# EAGLE design led_power_decoupling (EAGLE 7.7.0)
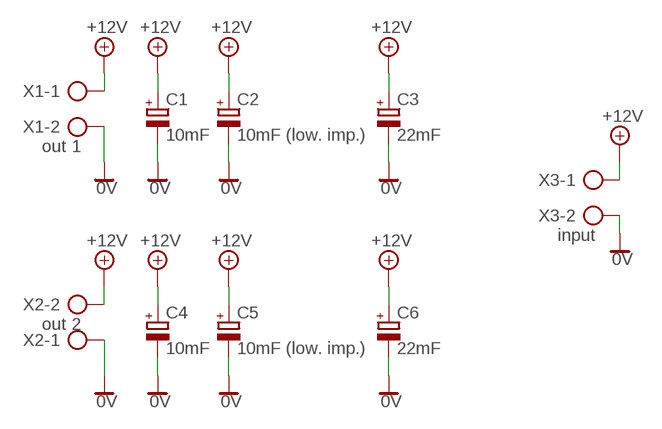
[diagram p0: schematic, sheet 1]

## Parts
C1  10mF  CPOL-EUE7.5-16  [E7,5-16]
C2  10mF (low. imp.)  CPOL-EUE7.5-18  [E7,5-18]
C3  22mF  CPOL-EUE10-25  [EB25D]
C4  10mF  CPOL-EUE7.5-16  [E7,5-16]
C5  10mF (low. imp.)  CPOL-EUE7.5-18  [E7,5-18]
C6  22mF  CPOL-EUE10-25  [EB25D]
X1  out 1  AK500/2  [AK500/2]
X2  out 2  AK500/2  [AK500/2]
X3  input  AK500/2  [AK500/2]

## Nets
0V: C1.- C2.- C3.- C4.- C5.- C6.- X1.2 X2.1 X3.2
+12V: C1.+ C2.+ C3.+ C4.+ C5.+ C6.+ X1.1 X2.2 X3.1

## Library data of the parts
C1-C6 = rcl:CPOL-EU: POLARIZED CAPACITOR, European symbol
X1-X3 = con-ptr500:AK500/2: CONNECTOR; OC_FARNELL: unknown; OC_NEWARK: unknown

## Board
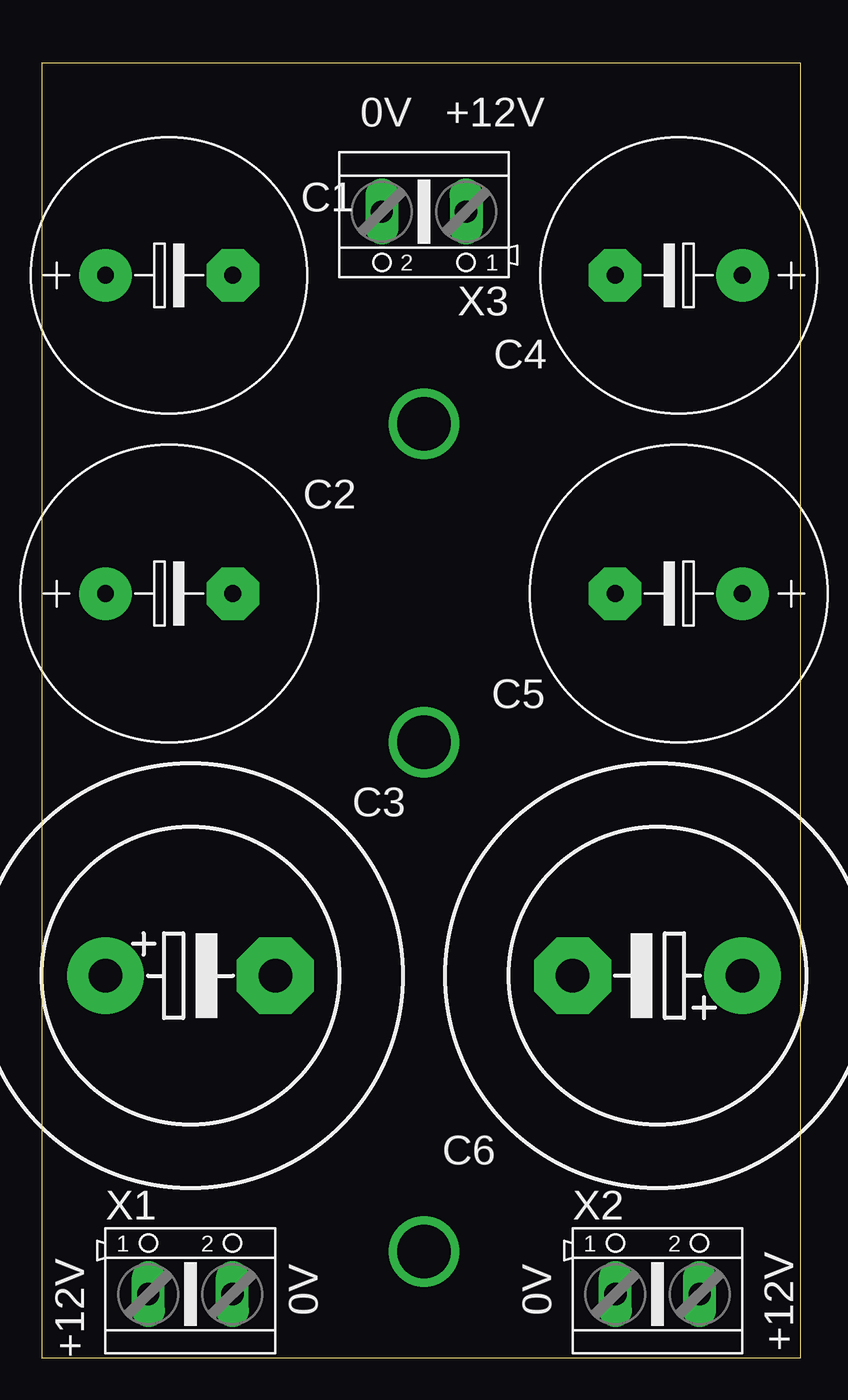
[diagram p1: board, top side]
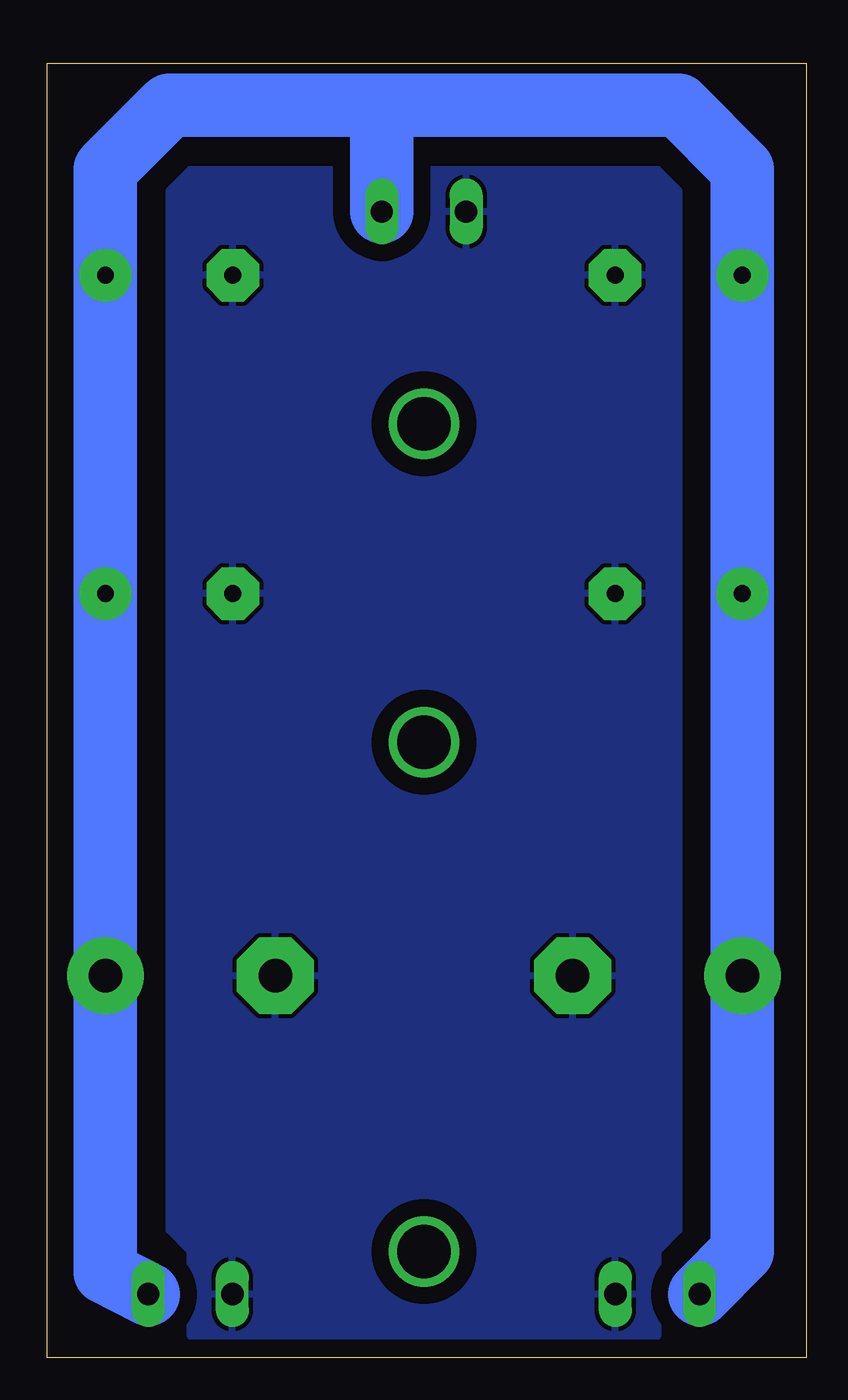
[diagram p2: board, bottom side, seen from below]

Size 45.39 x 77.46 mm. Coordinates in mm from the lower left corner, seen from the top.
Outline: 0,0 45.39,0 45.39,77.46 0,77.46 0,0
Copper layers (1*16): Top 0.035mm / dielectric 1.5mm / Bottom 0.035mm
Design rules "default": minimum track width 10mil, minimum drill 24mil, track to track 8mil, track to pad 8mil, pad to pad 8mil, via to via 8mil, smd to smd 8mil, copper to edge 40mil, drill to drill 8mil, minimum pad ring 10mil, minimum via ring 8mil, stop-mask expansion 4mil, vias tented up to drill 0mil, thermal gap 10mil

### Footprints (pad centres in the part's own frame; a part is rotated, then mirrored left to right if it is on the bottom)
E7,5-16 = drill 1.016 pad 3.15: + -3.81,0 | drill 1.016 pad 3.15 octagon: - 3.81,0
E7,5-18 = drill 1.016 pad 3.15: + -3.81,0 | drill 1.016 pad 3.15 octagon: - 3.81,0
EB25D = drill 2.007 pad 4.597: + -5.08,0 | drill 2.007 pad 4.597 octagon: - 5.08,0
AK500/2 = drill 1.321 long: 1 -2.515,0; 2 2.515,0

### Placement (x,y rotation side)
C1  7.62,64.77 0 top
C2  7.62,45.72 0 top
C3  8.89,22.86 0 top
C4  38.1,64.77 180 top
C5  38.1,45.72 180 top
C6  36.83,22.86 180 top
X1  8.89,3.81 0 top
X2  36.83,3.81 0 top
X3  22.86,68.58 180 top

### Tracks (layer width: path | path; a pad name or v marks a point on that pad's centre or on a via)
0V
  pour Bottom (isolate 1.016): 36.83,71.12 8.89,71.12 7.62,69.85 7.62,7.62 8.89,6.35 8.89,1.27 36.83,1.27 36.83,6.35 38.1,7.62 38.1,69.85
+12V
  Bottom 2.54: 25.38,73.64 25.4,74.93
  Bottom 3.81: X3.1 25.38,73.64 | X1.1 3.81,6.38 C3.+ C2.+ C1.+ 3.81,71.12 7.62,74.93 25.4,74.93 38.1,74.93 41.91,71.12 C4.+ C5.+ C6.+ 41.91,5.11 X2.2
N$1  (via drill 3.2)
  other vias: 22.86,55.88
N$2  (via drill 3.2)
  other vias: 22.86,6.35
N$3  (via drill 3.2)
  other vias: 22.86,36.83

### Text on the board
tNames: 0V | +12V | +12V | 0V | 0V | +12V